# Altium schematic sheet Sheet1.SchDoc
size A4; SheetNumber: 1; SheetTotal: 1
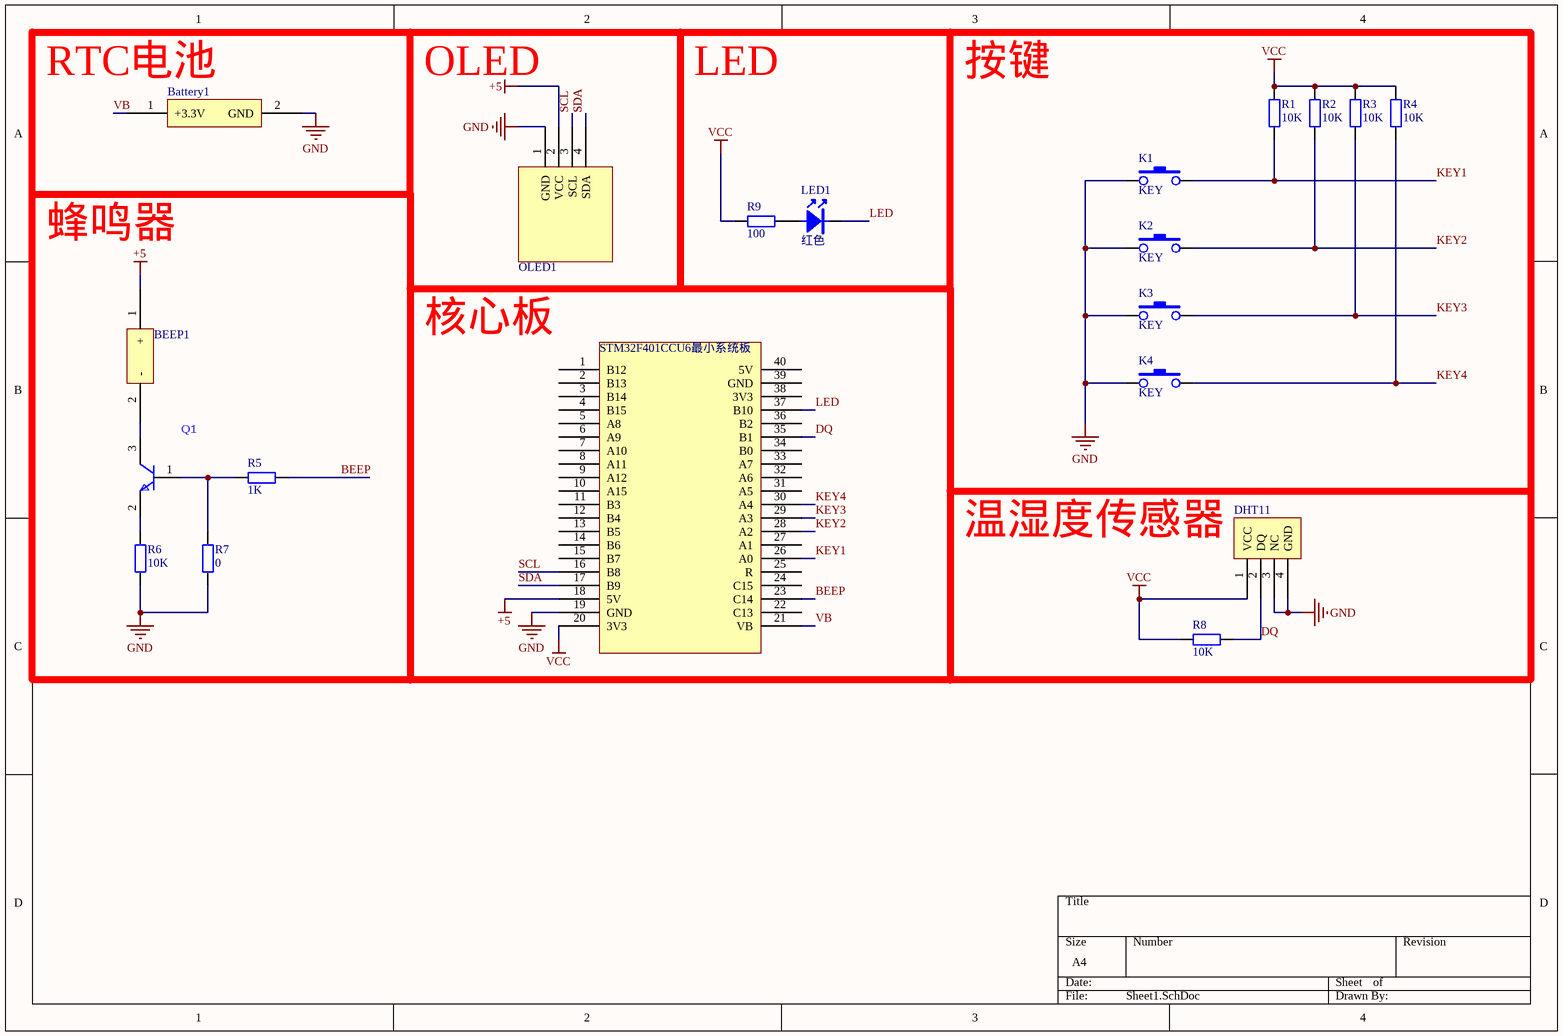
[diagram p0: Sheet1.SchDoc]

## Parts
Battery1  Battery  [Battery]  (value not drawn)
BEEP1  BEEP  [BEEP]  (value not drawn)
DHT11  DHT11  [DHT11]  (value not drawn)
K1  KEY  [TSW DIP-6*6*5]
K2  KEY  [TSW DIP-6*6*5]
K3  KEY  [TSW DIP-6*6*5]
K4  KEY  [TSW DIP-6*6*5]
LED1  红色  [LED 0805G]
OLED1  OLED  [OLED]  (value not drawn)
Q1  (no value)  [SOT-23]
R1  10K  [R 0805_M]
R2  10K  [R 0805_M]
R3  10K  [R 0805_M]
R4  10K  [R 0805_M]
R5  1K  [R 0805_M]
R6  10K  [R 0805_M]
R7  0  [R 0805_M]
R8  10K  [R 0805_M]
R9  100  [R 0805_M]
STM32F401CCU6最小系统板  STM32F401CCU6最小系统板  [STM32F401CCU6]  (value not drawn)

## Nets
+5: BEEP1.1(+) OLED1.2(VCC) STM32F401CCU6最小系统板.18(5V)
GND: Battery1.2(GND) DHT11.3(NC) DHT11.4(GND) K1.1 K2.1 K3.1 K4.1 OLED1.1(GND) R6.1 R7.1 STM32F401CCU6最小系统板.19(GND)
VCC: DHT11.1(VCC) R1.2 R2.2 R3.2 R4.2 R8.2 R9.1 STM32F401CCU6最小系统板.20(3V3)
BEEP: R5.2 STM32F401CCU6最小系统板.23(C14)
DQ: DHT11.2(DQ) R8.1 STM32F401CCU6最小系统板.35(B1)
KEY1: K1.2 R1.1 STM32F401CCU6最小系统板.26(A0)
KEY2: K2.2 R2.1 STM32F401CCU6最小系统板.28(A2)
KEY3: K3.2 R3.1 STM32F401CCU6最小系统板.29(A3)
KEY4: K4.2 R4.1 STM32F401CCU6最小系统板.30(A4)
LED: LED1.2(K) STM32F401CCU6最小系统板.37(B10)
SCL: OLED1.3(SCL) STM32F401CCU6最小系统板.16(B8)
SDA: OLED1.4(SDA) STM32F401CCU6最小系统板.17(B9)
VB: Battery1.1(+3.3V) STM32F401CCU6最小系统板.21(VB)
NetBEEP1_2: BEEP1.2(-) Q1.3(C)
NetLED1_1: LED1.1(A) R9.2
NetQ1_1: Q1.1(B) R5.1 R7.2
NetQ1_2: Q1.2(E) R6.2

Not connected (* = marked no-connect by the designer): STM32F401CCU6最小系统板 1(B12) 2(B13) 3(B14) 4(B15) 5(A8) 6(A9) 7(A10) 8(A11) 9(A12) 10(A15) 11(B3) 12(B4) 13(B5) 14(B6) 15(B7) 22(C13) 24(C15) 25(R) 27(A1) 31(A5) 32(A6) 33(A7) 34(B0) 36(B2) 38(3V3) 39(GND) 40(5V)

## Notes on the sheet
- (near Battery1) RTC电池
- OLED
- LED
- 按键
- 蜂鸣器
- 核心板
- 温湿度传感器

## Library data of the parts
K1-K4 = KEY: 四角直插开关; 淘宝ID: 小糖豆的小窝窝; BOM名称: 四角直插开关; 下单链接: https://item.taobao.com/item.htm?ft=t&id=613637044352
LED1 = LED-SMD: 贴片LED; 淘宝ID: 小糖豆的小窝窝; BOM名称: 贴片LED; 下单链接: https://item.taobao.com/item.htm?ft=t&id=613637044352
Q1 = S9013LT1
R1-R9 = R: 贴片电阻; 淘宝ID: 小糖豆的小窝窝; BOM名称: 贴片电阻; 下单链接: https://item.taobao.com/item.htm?ft=t&id=613637044352
STM32F401CCU6最小系统板 = STM32F401CCU6